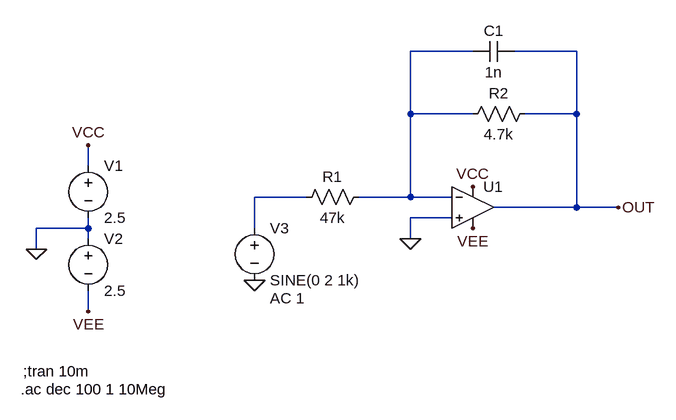
[diagram p0: schematic DAC Filter.asc]
DAC Filter.asc, the LTspice schematic file:
Version 4
SHEET 1 916 680
WIRE 624 -48 528 -48
WIRE 784 -48 688 -48
WIRE 528 48 528 -48
WIRE 624 48 528 48
WIRE 784 48 784 -48
WIRE 784 48 704 48
WIRE 32 128 32 96
WIRE 368 176 288 176
WIRE 528 176 528 48
WIRE 528 176 448 176
WIRE 592 176 528 176
WIRE 784 192 784 48
WIRE 784 192 656 192
WIRE 848 192 784 192
WIRE 592 208 528 208
WIRE 32 224 32 208
WIRE 32 224 -48 224
WIRE 288 224 288 176
WIRE 32 240 32 224
WIRE 528 240 528 208
WIRE -48 256 -48 224
WIRE 32 352 32 320
FLAG -48 256 0
FLAG 32 96 VCC
FLAG 624 160 VCC
FLAG 624 224 VEE
FLAG 32 352 VEE
FLAG 528 240 0
FLAG 288 304 0
FLAG 848 192 OUT
SYMBOL voltage 32 112 R0
WINDOW 123 0 0 Left 0
WINDOW 39 0 0 Left 0
SYMATTR InstName V1
SYMATTR Value 2.5
SYMBOL OpAmps\\UniversalOpamp 624 192 R0
SYMATTR InstName U1
SYMBOL voltage 32 224 R0
WINDOW 123 0 0 Left 0
WINDOW 39 0 0 Left 0
SYMATTR InstName V2
SYMATTR Value 2.5
SYMBOL voltage 288 208 R0
WINDOW 123 24 124 Left 2
WINDOW 39 0 0 Left 0
SYMATTR InstName V3
SYMATTR Value SINE(0 2 1k)
SYMATTR Value2 AC 1
SYMBOL res 464 160 R90
WINDOW 0 0 56 VBottom 2
WINDOW 3 32 56 VTop 2
SYMATTR InstName R1
SYMATTR Value 47k
SYMBOL res 720 32 R90
WINDOW 0 0 56 VBottom 2
WINDOW 3 32 56 VTop 2
SYMATTR InstName R2
SYMATTR Value 4.7k
SYMBOL cap 688 -64 R90
WINDOW 0 0 32 VBottom 2
WINDOW 3 32 32 VTop 2
SYMATTR InstName C1
SYMATTR Value 1n
TEXT -68 444 Left 2 !;tran 10m
TEXT -72 472 Left 2 !.ac dec 100 1 10Meg

The netlist it stands for:
* DAC Filter.asc
V1 VCC 0 2.5
XU1 0 N001 VCC VEE OUT level1 Avol=1Meg GBW=10Meg Vos=0 En=0 Enk=0 In=0 Ink=0 Rin=500Meg  ; pins In+ In- V+ V- OUT
V2 0 VEE 2.5
V3 N002 0 SINE(0 2 1k) AC 1
R1 N001 N002 47k
R2 OUT N001 4.7k
C1 OUT N001 1n
;tran 10m
.ac dec 100 1 10Meg
.lib UniversalOpAmp1.lib
.backanno
.end